# Altium schematic sheet INPUT.SchDoc: INPUT
size 420 x 297 mm; Date: March 14; CheckedBy: ThS. Bùi Quốc Bảo; DrawnBy: Nguyễn Gia Huy; Revision: V1.0; SheetNumber: 4; SheetTotal: 11; MasterProject: STM32-PLC; Sub-system: DA1_prj.PrjPcb
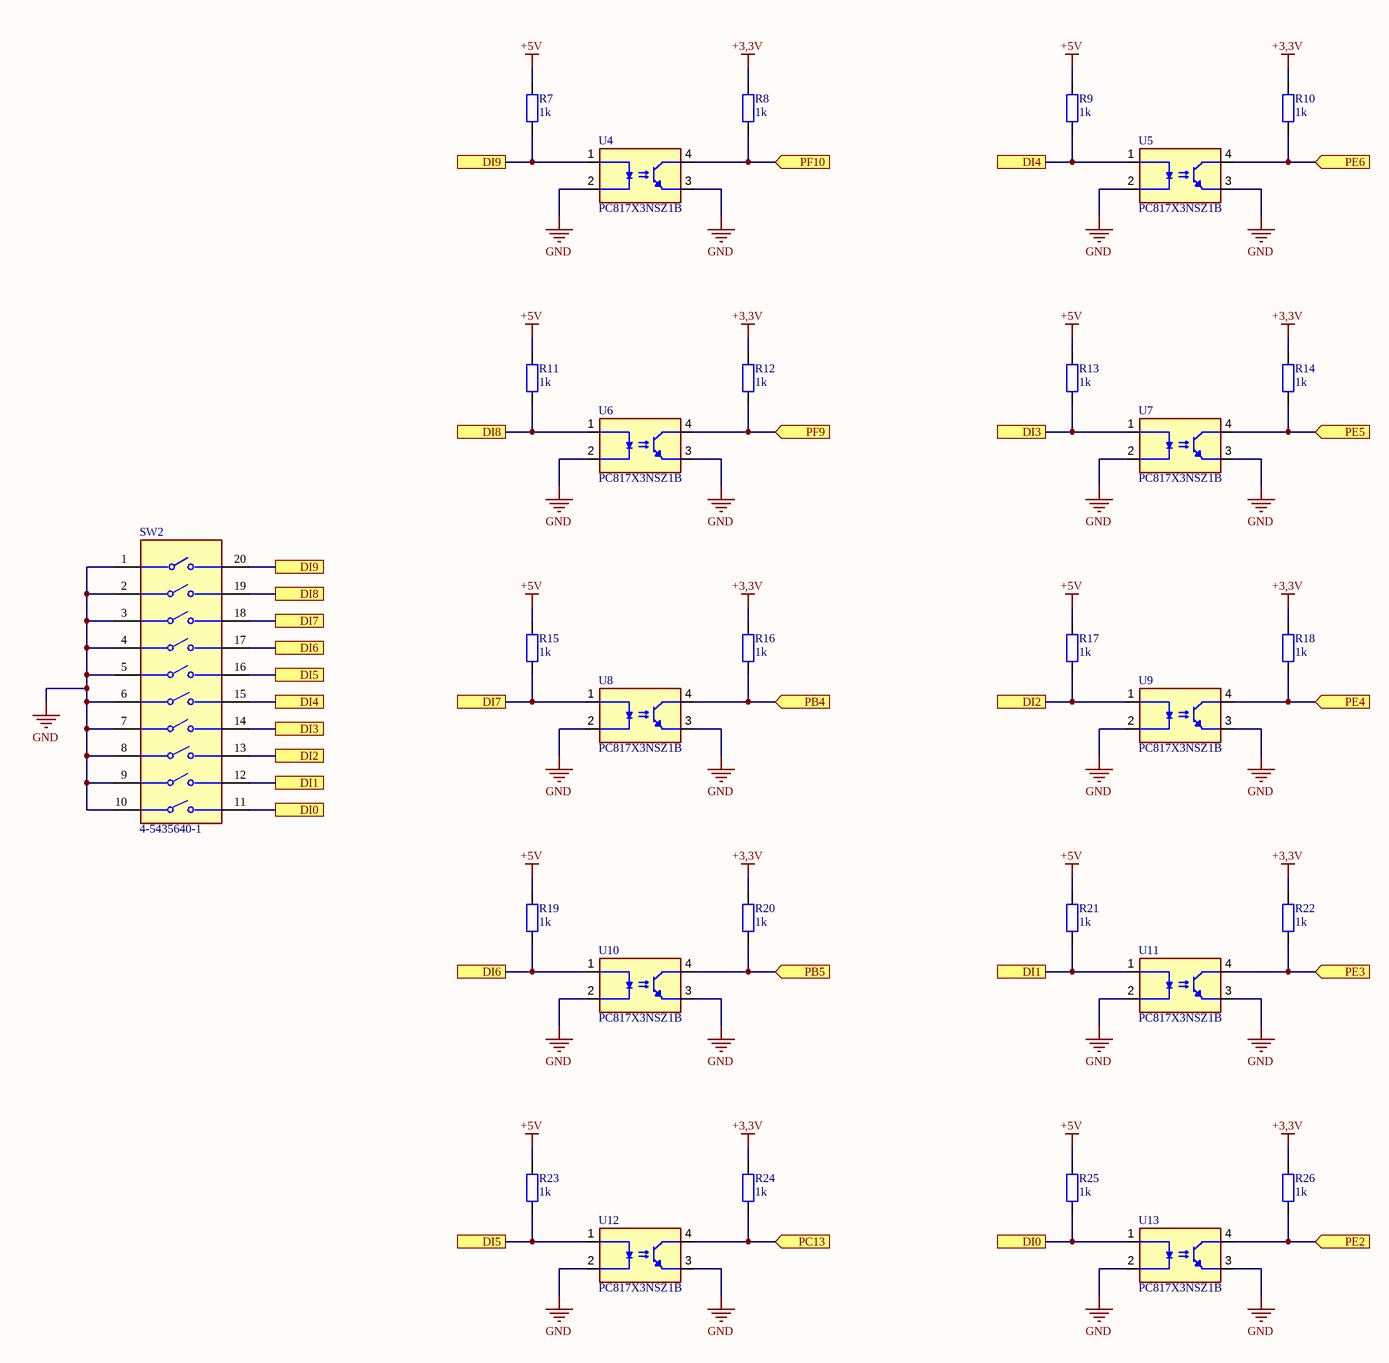
[diagram p0: INPUT.SchDoc]

## Parts
R7  1k  [tro smd 0603]
R8  1k  [tro smd 0603]
R9  1k  [tro smd 0603]
R10  1k  [tro smd 0603]
R11  1k  [tro smd 0603]
R12  1k  [tro smd 0603]
R13  1k  [tro smd 0603]
R14  1k  [tro smd 0603]
R15  1k  [tro smd 0603]
R16  1k  [tro smd 0603]
R17  1k  [tro smd 0603]
R18  1k  [tro smd 0603]
R19  1k  [tro smd 0603]
R20  1k  [tro smd 0603]
R21  1k  [tro smd 0603]
R22  1k  [tro smd 0603]
R23  1k  [tro smd 0603]
R24  1k  [tro smd 0603]
R25  1k  [tro smd 0603]
R26  1k  [tro smd 0603]
SW2  4-5435640-1  [FP-4-5435640-1-MFG]
U4  PC817X3NSZ1B  [DIP762W50P254L495H455Q4]
U5  PC817X3NSZ1B  [DIP762W50P254L495H455Q4]
U6  PC817X3NSZ1B  [DIP762W50P254L495H455Q4]
U7  PC817X3NSZ1B  [DIP762W50P254L495H455Q4]
U8  PC817X3NSZ1B  [DIP762W50P254L495H455Q4]
U9  PC817X3NSZ1B  [DIP762W50P254L495H455Q4]
U10  PC817X3NSZ1B  [DIP762W50P254L495H455Q4]
U11  PC817X3NSZ1B  [DIP762W50P254L495H455Q4]
U12  PC817X3NSZ1B  [DIP762W50P254L495H455Q4]
U13  PC817X3NSZ1B  [DIP762W50P254L495H455Q4]

## Ports
DI0 (see INPUT[1C], STM32_PLC[2D]), DI0 (see INPUT[3D], STM32_PLC[2D]), DI1 (see INPUT[1C], STM32_PLC[2D]), DI1 (see INPUT[3C], STM32_PLC[2D]), DI2 (see INPUT[1C], STM32_PLC[2D]), DI2 (see INPUT[3B], STM32_PLC[2D]), DI3 (see INPUT[1C], STM32_PLC[2D]), DI3 (see INPUT[3B], STM32_PLC[2D]), DI4 (see INPUT[1B], STM32_PLC[2D]), DI4 (see INPUT[3A], STM32_PLC[2D]), DI5 (see INPUT[1B], STM32_PLC[2D]), DI5 (see INPUT[2D], STM32_PLC[2D]), DI6 (see INPUT[1B], STM32_PLC[2D]), DI6 (see INPUT[2C], STM32_PLC[2D]), DI7 (see INPUT[1B], STM32_PLC[2D]), DI7 (see INPUT[2B], STM32_PLC[2D]), DI8 (see INPUT[1B], STM32_PLC[2D]), DI8 (see INPUT[2B], STM32_PLC[2D]), DI9 (see INPUT[1B], STM32_PLC[2D]), DI9 (see INPUT[2A], STM32_PLC[2D]), PB4 (in, see STM32_PLC[2B], STM32_PLC[2D]), PB5 (in, see STM32_PLC[2B], STM32_PLC[2D]), PC13 (in, see STM32_PLC[2D], STM32_PLC[3B]), PE2 (in, see STM32_PLC[2C], STM32_PLC[2D]), PE3 (in, see STM32_PLC[2C], STM32_PLC[2D]), PE4 (in, see STM32_PLC[2C], STM32_PLC[2D]), PE5 (in, see STM32_PLC[2C], STM32_PLC[2D]), PE6 (in, see STM32_PLC[2C], STM32_PLC[2D]), PF9 (in, see STM32_PLC[2C], STM32_PLC[2D]), PF10 (in, see STM32_PLC[2C], STM32_PLC[2D])

## Nets
+3,3V: R8.2 R10.2 R12.2 R14.2 R16.2 R18.2 R20.2 R22.2 R24.2 R26.2
+5V: R7.2 R9.2 R11.2 R13.2 R15.2 R17.2 R19.2 R21.2 R23.2 R25.2
GND: SW2.1 SW2.2 SW2.3 SW2.4 SW2.5 SW2.6 SW2.7 SW2.8 SW2.9 SW2.10 U4.2(CATHODE) U4.3(EMITTER) U5.2(CATHODE) U5.3(EMITTER) U6.2(CATHODE) U6.3(EMITTER) U7.2(CATHODE) U7.3(EMITTER) U8.2(CATHODE) U8.3(EMITTER) U9.2(CATHODE) U9.3(EMITTER) U10.2(CATHODE) U10.3(EMITTER) U11.2(CATHODE) U11.3(EMITTER) U12.2(CATHODE) U12.3(EMITTER) U13.2(CATHODE) U13.3(EMITTER)
DI0: R25.1 SW2.11 U13.1(ANODE) ; port DI0
DI1: R21.1 SW2.12 U11.1(ANODE) ; port DI1
DI2: R17.1 SW2.13 U9.1(ANODE) ; port DI2
DI3: R13.1 SW2.14 U7.1(ANODE) ; port DI3
DI4: R9.1 SW2.15 U5.1(ANODE) ; port DI4
DI5: R23.1 SW2.16 U12.1(ANODE) ; port DI5
DI6: R19.1 SW2.17 U10.1(ANODE) ; port DI6
DI7: R15.1 SW2.18 U8.1(ANODE) ; port DI7
DI8: R11.1 SW2.19 U6.1(ANODE) ; port DI8
DI9: R7.1 SW2.20 U4.1(ANODE) ; port DI9
PB4: R16.1 U8.4(COLLECTOR) ; port PB4
PB5: R20.1 U10.4(COLLECTOR) ; port PB5
PC13: R24.1 U12.4(COLLECTOR) ; port PC13
PE2: R26.1 U13.4(COLLECTOR) ; port PE2
PE3: R22.1 U11.4(COLLECTOR) ; port PE3
PE4: R18.1 U9.4(COLLECTOR) ; port PE4
PE5: R14.1 U7.4(COLLECTOR) ; port PE5
PE6: R10.1 U5.4(COLLECTOR) ; port PE6
PF9: R12.1 U6.4(COLLECTOR) ; port PF9
PF10: R8.1 U4.4(COLLECTOR) ; port PF10

## Notes on the sheet
- Sub-system:
- Project:
- Design by:
- Sheet title:
- Sheet
- of
- Checked by:
- Approved by:
- Doc No:
- Revision:
- Size:
- Dates:
- A3

## Library data of the parts
R7-R26 = Tro 0603 1% 10k: RES; Chung_Loai: Dán; Don_Vi: Con; So_Chan: 2; Ten_Linh_Kien: Trở 0603 1% 10k; Ma_Hang: MH006333; Kieu_Chan: *
SW2 = CMP-03400-000018-1: SWITCH ROCKER DIP SPST 60MA 5V; Number of Circuits: 10; Contact Post Length: 0.14inch; Washable: Yes; Contact Current Rating: 1A; Voltage Rating (DC): 40V; Sealable: Yes (With); Pitch: 0.1inch; Terminal Pitch: 2.54mm; Height: 0.34inch; Contact Plating: Gold; Mount: Through Hole; Orientation: Straight; Type: Switch; RoHS Compliant: Yes; Contact Material: Copper Alloy; Housing Material: Polyester; Package Quantity: 11; Termination: PC Pins; ELV: Compliant; Packaging: Rail/Tube; Actuator Type: Rocker; Housing Color: Blue; Min Operating Temperature: -55°C; Max Operating Temperature: 105°C; Length: 27.43mm; Lead Free: Lead Free; Radiation Hardening: No; Series: 7100; Number of Positions: 10; Throw Configuration: SPST
U4-U13 = PC817X3NSZ1B: Optoisolator Transistor Output - 1 Channel 4-DIP; MF: Sharp Microelectronics; SnapEDA_Link: https://www.snapeda.com/parts/PC817X3NSZ1B/Sharp+Microelectronics/view-part/?ref=snap; Price: None; Purchase-URL: https://pricing.snapeda.com/search/part/PC817X3NSZ1B/?ref=eda; Check_prices: https://www.snapeda.com/parts/PC817X3NSZ1B/Sharp+Microelectronics/view-part/?ref=eda; MP: PC817X3NSZ1B; Value: *; Availability: In Stock; Package: DIP-4 Sharp Microelectronics